# EAGLE design emat_igbt_switch_schmitt_trigger_40106 (EAGLE 9.2.2)
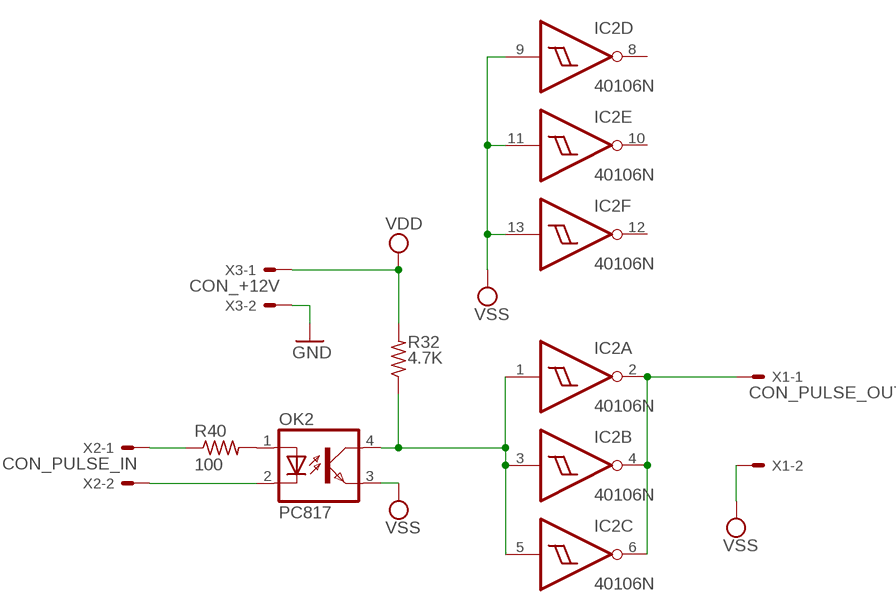
[diagram p0: schematic, sheet 1]

## Parts
IC2  40106N  [DIL14]
OK2  PC817  [DIL04]
R32  4.7K  R-US_R1206  [R1206]
R40  100  R-US_R1206  [R1206]
X1  CON_PULSE_OUT  22-23-2021  [22-23-2021]
X2  CON_PULSE_IN  22-23-2021  [22-23-2021]
X3  CON_+12V  22-23-2021  [22-23-2021]

## Nets
GND: X3.2
N$1: IC2.2(A:O) IC2.4(B:O) IC2.6(C:O) X1.1
N$13: OK2.2(C) X2.2
N$17: IC2.1(A:I) IC2.3(B:I) IC2.5(C:I) OK2.4(COL) R32.1
N$31: R40.1 X2.1
N$32: OK2.1(A) R40.2
VDD: R32.2 X3.1
VSS: IC2.9(D:I) IC2.11(E:I) IC2.13(F:I) OK2.3(EMIT) X1.2
Unconnected: IC2.8(D:O) IC2.10(E:O) IC2.12(F:O)

## Power pins joined to a net without a drawn wire
VDD: IC2.14(P:VDD)
VSS: IC2.7(P:VSS)

## Library data of the parts
IC2 = 40xx:40106: Hex SCHMITT TRIGGER
OK2 = optocoupler:PC817: SHARP OPTO COUPLER; MPN: PC817X4J000F; OC_FARNELL: 9707727; OC_NEWARK: 97K7059
R32 = rcl:R-US_: RESISTOR, American symbol
R40 = resistor:R-US_: RESISTOR, American symbol
X1-X3 = con-molex:22-23-2021: .100" (2.54mm) Center Header - 2 Pin; MF: MOLEX; MPN: 22-23-2021; OC_FARNELL: 1462926; OC_NEWARK: 25C3832

## Net classes
0 default: width 0.3 mm, drill 0.3 mm, clearance 0.3 mm

## Board
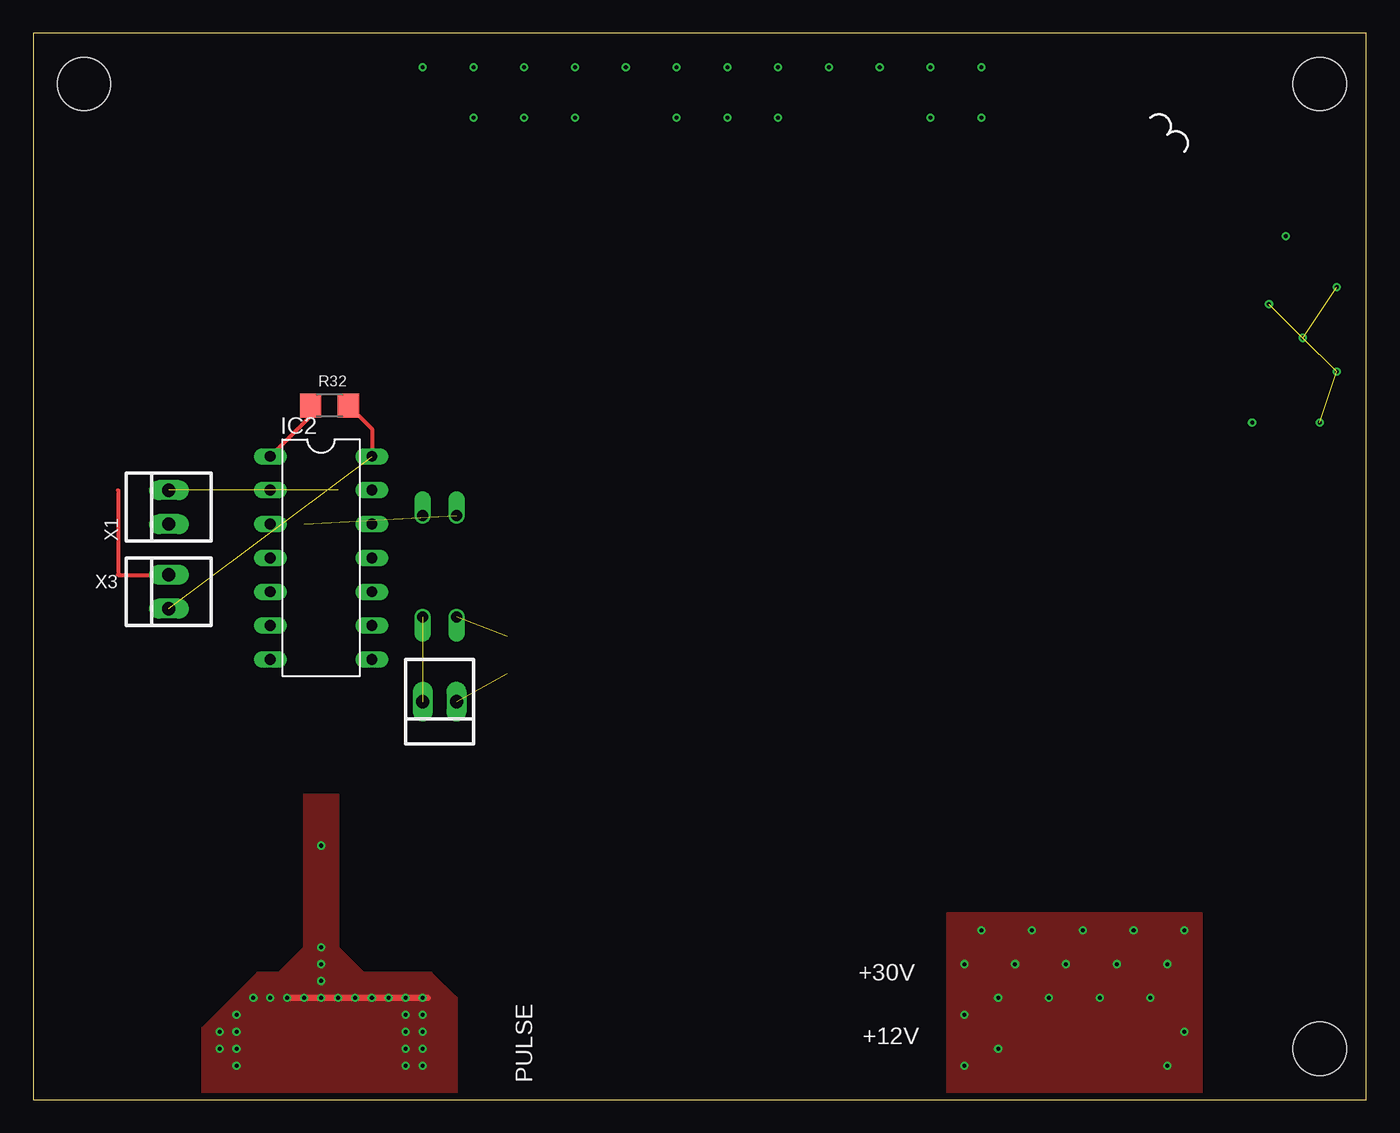
[diagram p1: board, top side]
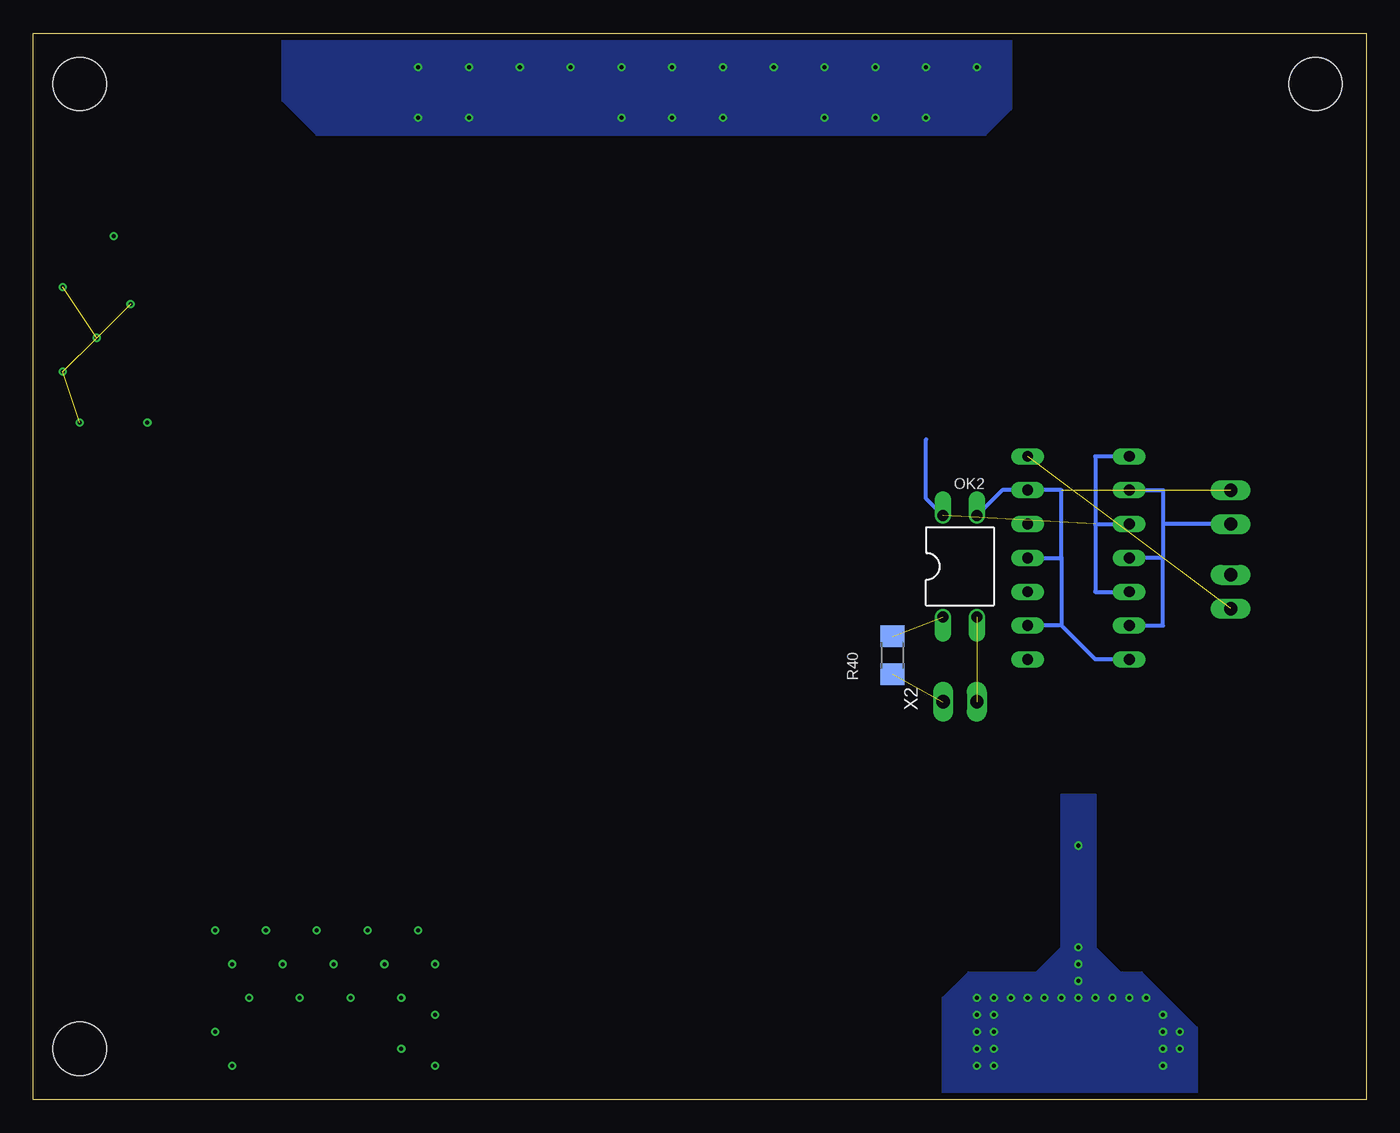
[diagram p2: board, bottom side, seen from below]

Size 100 x 80 mm. Coordinates in mm from the lower left corner, seen from the top.
Outline: 0,0 100,0 100,80 0,80 0,0
Copper layers (1*16): Top 0.035mm / dielectric 1.6mm / Bottom 0.035mm
Design rules "Elecrow_2-layer_PCB_eagle_rule *": minimum track width 6mil, minimum drill 12mil, track to track 0.3mm, track to pad 0.3mm, pad to pad 0.3mm, via to via 0.3mm, smd to smd 0mil, copper to edge 20mil, drill to drill 10mil, minimum pad ring 6mil, minimum via ring 6mil, stop-mask expansion 0mil, vias tented up to drill 100mil, thermal gap 10mil
Holes 4 mm at 3.81,76.2 96.52,3.81 96.52,76.2

### Footprints (pad centres in the part's own frame; a part is rotated, then mirrored left to right if it is on the bottom)
DIL14 = drill 0.813 long: 1 -7.62,-3.81; 2 -5.08,-3.81; 3 -2.54,-3.81; 4 0,-3.81; 5 2.54,-3.81; 6 5.08,-3.81; 7 7.62,-3.81; 8 7.62,3.81; 9 5.08,3.81; 10 2.54,3.81; 11 0,3.81; 12 -2.54,3.81; 13 -5.08,3.81; 14 -7.62,3.81
DIL04 = drill 0.813 offset: 1 -1.27,-3.81; 2 1.27,-3.81; 3 1.27,3.81; 4 -1.27,3.81
R1206 = smd 1.6 x 1.803: 1 -1.422,0; 2 1.422,0
22-23-2021 = drill 1 long: 1 -1.27,0; 2 1.27,0

### Placement (x,y rotation side)
IC2  21.59,40.64 270 top
OK2  30.48,40.01 0 bottom
R32  22.23,52.07 0 top
R40  35.56,33.34 90 bottom
X1  10.16,44.45 90 top
X2  30.48,29.84 180 top
X3  10.16,38.1 90 top

### Tracks (layer width: path | path; a pad name or v marks a point on that pad's centre or on a via)
GND
  Top 0.3: 6.35,45.72 6.35,39.37 X3.2
N$1
  Bottom 0.3: IC2.2 15.24,45.72 15.24,43.18 | 15.24,43.18 15.24,40.64 | 15.24,40.64 IC2.4 | IC2.6 15.24,35.56 15.24,40.64 | X1.1 15.24,43.18
N$3  (via drill 0.3)  (4 unrouted)
  other vias: 92.71,59.69 97.79,60.96 95.25,57.15 97.79,54.61 96.52,50.8
N$5  (via drill 0.3)
  other vias: 93.98,64.77
N$6  (via drill 0.3)
  other vias: 91.44,50.8
N$7  (via drill 0.3)
  other vias: 29.21,77.47 33.02,77.47 36.83,77.47 40.64,77.47 44.45,77.47 48.26,77.47 52.07,77.47 55.88,77.47 59.69,77.47 63.5,77.47 67.31,77.47 33.02,73.66 36.83,73.66 40.64,73.66 48.26,73.66 52.07,73.66 55.88,73.66 67.31,73.66 71.12,77.47 71.12,73.66
  pour Bottom (no thermals): 26.67,80.01 26.67,74.3 28.57,72.39 78.74,72.39 81.28,74.93 81.28,80.01
N$8  (via drill 0.3)
  Top 0.5: v19.05,7.62 29.59,7.62
  other vias: 15.24,6.35 15.24,5.08 15.24,3.81 15.24,2.54 13.97,3.81 13.97,5.08 16.51,7.62 17.78,7.62 20.32,7.62 21.59,7.62 22.86,7.62 25.4,7.62 24.13,7.62 26.67,7.62 27.94,7.62 27.94,6.35 27.94,5.08 27.94,3.81 27.94,2.54 29.21,2.54 29.21,3.81 29.21,5.08 29.21,6.35 29.21,7.62 21.59,8.89 21.59,10.16 21.59,11.43 21.59,19.05
  pour Bottom (isolate 0.3, no thermals): 20.32,22.86 22.86,22.86 22.86,11.43 24.77,9.53 29.84,9.53 31.75,7.62 31.75,0 12.7,0 12.7,5.4 16.83,9.53 18.41,9.53 20.32,11.43
  pour Top (isolate 0.3, no thermals): 20.32,22.86 22.86,22.86 22.86,11.43 24.77,9.53 29.84,9.53 31.75,7.62 31.75,0 12.7,0 12.7,5.4 16.83,9.53 18.41,9.53 20.32,11.43
N$9  (via drill 0.3)
  other vias: 69.85,2.54 85.09,2.54 72.39,3.81 69.85,6.35 72.39,7.62 76.2,7.62 80.01,7.62 83.82,7.62 69.85,10.16 71.12,12.7 73.66,10.16 74.93,12.7 77.47,10.16 78.74,12.7 81.28,10.16 82.55,12.7 85.09,10.16 86.36,12.7 86.36,5.08
  pour Top (no thermals): 68.58,0 68.58,13.97 87.63,13.97 87.63,0
N$13  (1 unrouted)
N$17  (1 unrouted)
  Top 0.3: IC2.1 20.8,51.28 R32.1
  Bottom 0.3: IC2.1 20.32,48.26 20.32,43.18 | 20.32,43.18 IC2.3 | 20.32,43.18 20.32,38.1 IC2.5 | OK2.4 33.02,45.09 33.02,49.53
N$31  (1 unrouted)
N$32  (1 unrouted)
VDD  (1 unrouted)
  Top 0.3: R32.2 25.4,50.32 IC2.14
VSS  (1 unrouted)
  Bottom 0.3: IC2.7 20.32,33.02 22.86,35.56 | 22.86,35.56 IC2.9 | IC2.11 22.86,40.64 | 22.86,40.64 22.86,35.56 | 22.86,40.64 22.86,45.72 IC2.13 27.3,45.72 OK2.3

### Text on the board
tNames: +30V | +12V | PULSE